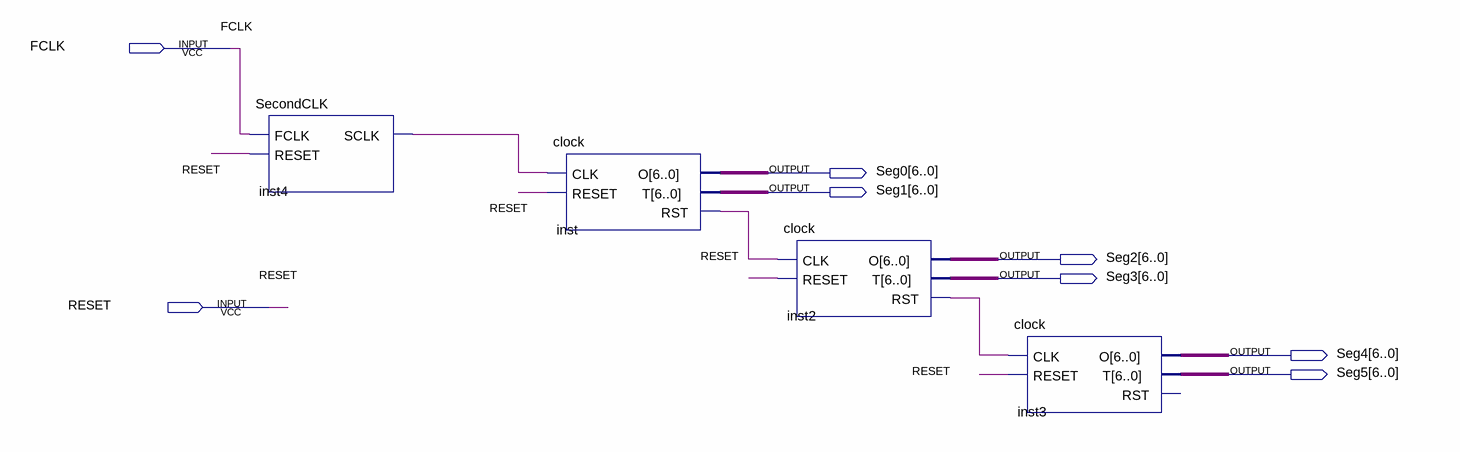
[diagram p0: schematic sheet]
// Quartus schematic SMHClock.bdf as structural Verilog: 4 symbols, 8 pins
module SMHClock (
  input  FCLK,
  input  RESET,
  output [6:0] Seg0,
  output [6:0] Seg1,
  output [6:0] Seg2,
  output [6:0] Seg3,
  output [6:0] Seg4,
  output [6:0] Seg5
);

  wire inst2_rst, inst4_sclk, inst_rst;

  SecondCLK inst4 (.FCLK(FCLK), .RESET(RESET), .SCLK(inst4_sclk));
  clock inst (.CLK(inst4_sclk), .RESET(RESET), .O(Seg0), .T(Seg1), .RST(inst_rst));
  clock inst2 (.CLK(inst_rst), .RESET(RESET), .O(Seg2), .T(Seg3), .RST(inst2_rst));
  clock inst3 (.CLK(inst2_rst), .RESET(RESET), .O(Seg4), .T(Seg5));  // open: RST
endmodule
